# EAGLE design seismometer_panelboard (EAGLE 7.0.0)
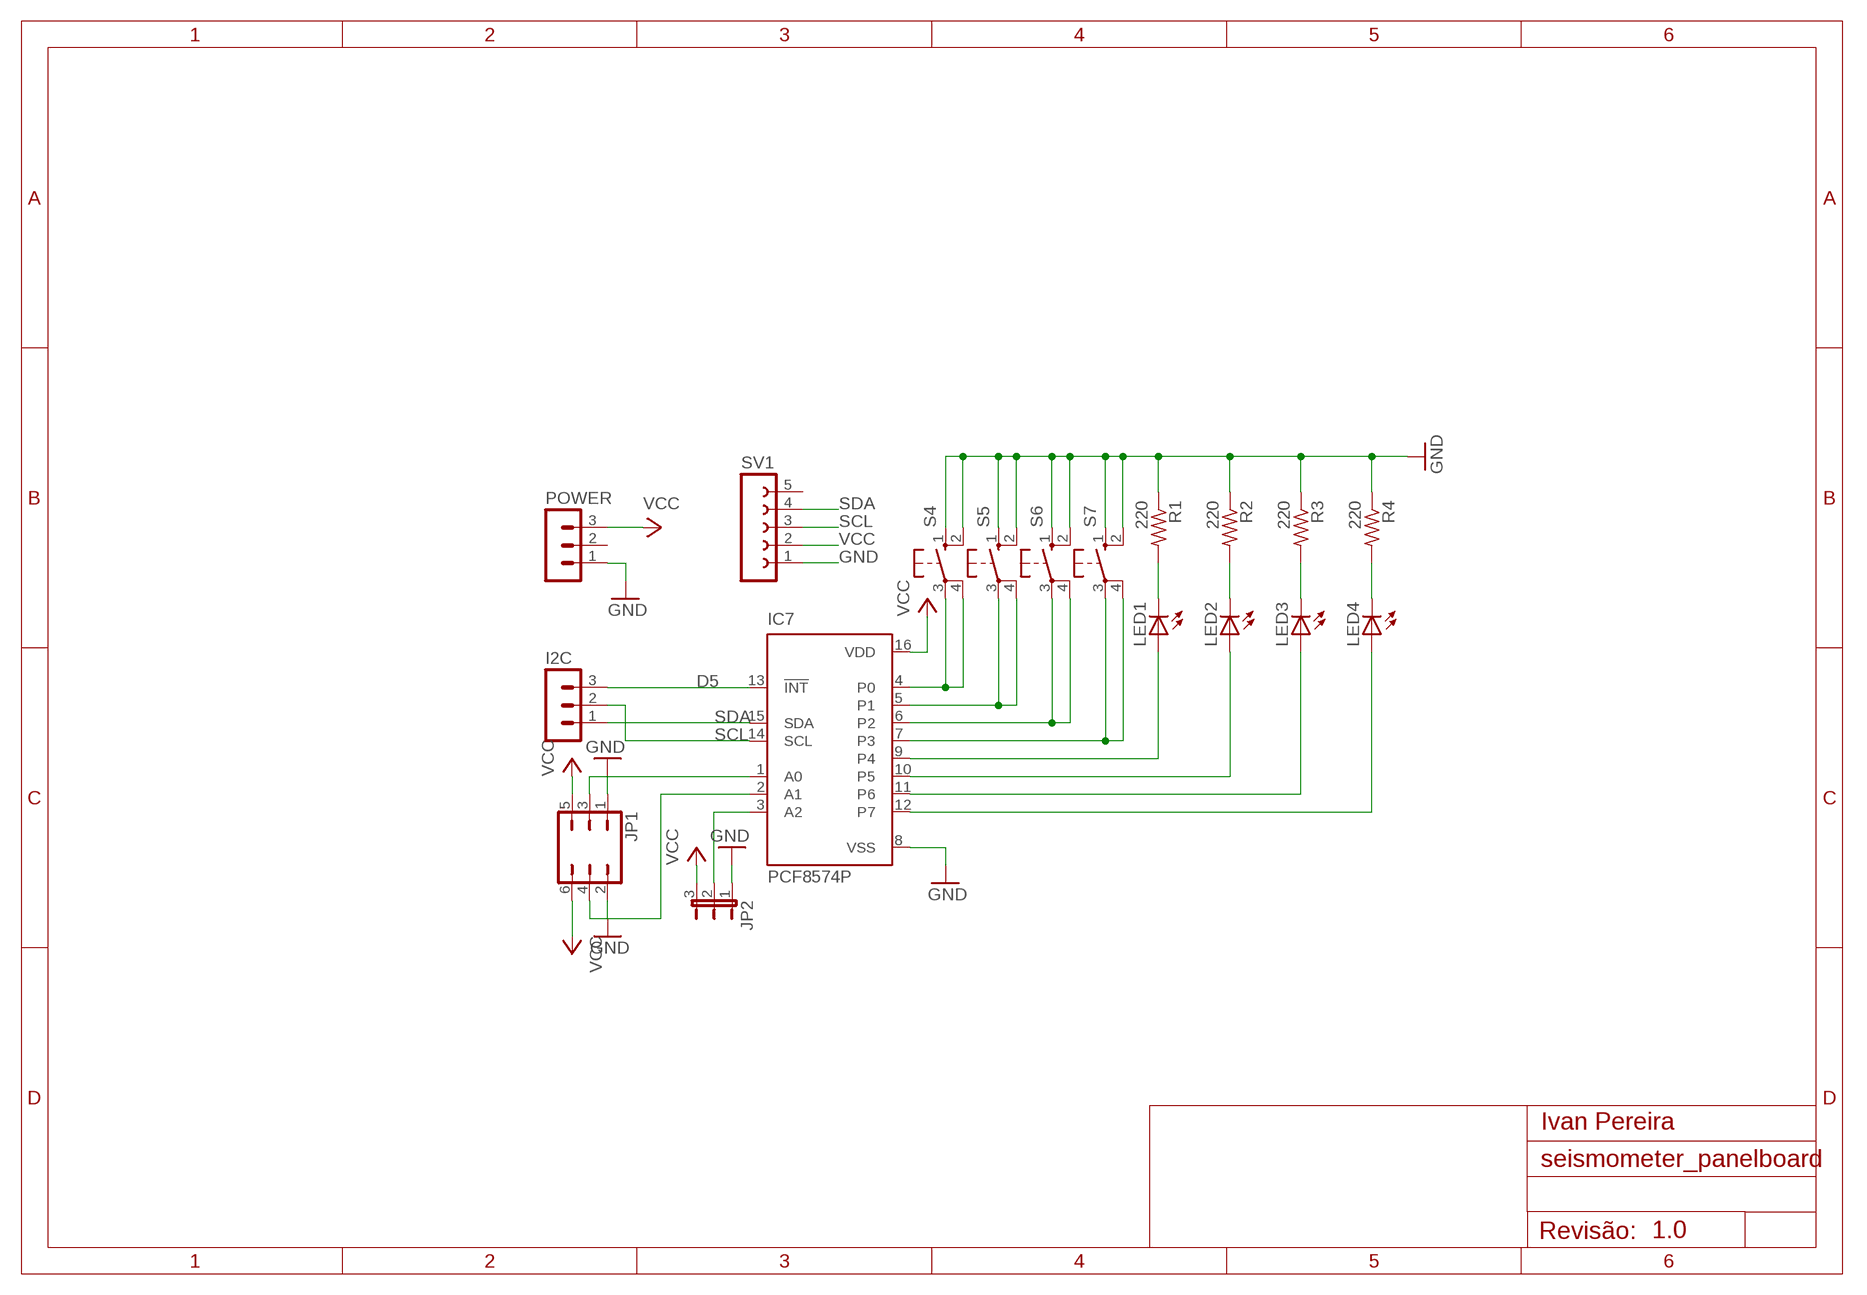
[diagram p0: schematic, sheet 1]
FRAME1 (A4L-LOC): AUTHOR: Ivan Pereira; REV: 1.0

## Parts
I2C  MA03-1  [MA03-1]
IC7  PCF8574P  [DIL16]
JP1  JP3Q  [JP3Q]
JP2  JP2E  [JP2]
LED1  LED3MM  [LED3MM]
LED2  LED3MM  [LED3MM]
LED3  LED3MM  [LED3MM]
LED4  LED3MM  [LED3MM]
POWER  MA03-1  [MA03-1]
R1  220  R-US_0207/10  [0207/10]
R2  220  R-US_0207/10  [0207/10]
R3  220  R-US_0207/10  [0207/10]
R4  220  R-US_0207/10  [0207/10]
S4  10-XX  [B3F-10XX]
S5  10-XX  [B3F-10XX]
S6  10-XX  [B3F-10XX]
S7  10-XX  [B3F-10XX]
SV1  FE05-1  [FE05-1]

## Nets
D5: I2C.3 IC7.13(!INT)
GND: IC7.8(VSS) JP1.1 JP1.2 JP2.1 POWER.1 R1.1 R2.1 R3.1 R4.1 S4.1(S) S4.2(S1) S5.1(S) S5.2(S1) S6.1(S) S6.2(S1) S7.1(S) S7.2(S1) SV1.1
N$1: IC7.9(P4) LED1.A
N$2: IC7.10(P5) LED2.A
N$3: IC7.11(P6) LED3.A
N$4: IC7.12(P7) LED4.A
N$5: LED1.K(C) R1.2
N$6: LED2.K(C) R2.2
N$7: LED3.K(C) R3.2
N$8: LED4.K(C) R4.2
N$9: IC7.1(A0) JP1.3
N$10: IC7.2(A1) JP1.4
N$11: IC7.3(A2) JP2.2
N$30: IC7.4(P0) S4.3(P) S4.4(P1)
N$32: IC7.6(P2) S6.3(P) S6.4(P1)
N$33: IC7.7(P3) S7.3(P) S7.4(P1)
N$34: IC7.5(P1) S5.3(P) S5.4(P1)
SCL: I2C.2 IC7.14(SCL) SV1.3
SDA: I2C.1 IC7.15(SDA) SV1.4
VCC: IC7.16(VDD) JP1.5 JP1.6 JP2.3 POWER.3 SV1.2
Unconnected: POWER.2 SV1.5

## Library data of the parts
I2C POWER = con-lstb:MA03-1: PIN HEADER; OC_FARNELL: unknown; OC_NEWARK: unknown
IC7 = micro-philips:PCF8574: I2C-Bus Remote 8-bit I/O expander http://www.semiconductors.philips.com/acrobat_download/datasheets/PCF8574_4.pdf; MPN: PCF8574PN; OC_FARNELL: 204020; OC_NEWARK: 11N8515
JP1 = jumper:JP3Q: JUMPER
JP2 = jumper:JP2E: JUMPER
LED1-LED4 = adafruit:LED: LED OSRAM: - CHIPLED LG R971, LG N971, LY N971, LG Q971, LY Q971, LO R971, LY R971 LH N974, LH R974 LS Q976, LO Q976, LY Q976 LO Q996 - Hyper CHIPLED LW Q18S LB Q993, LB Q99A, LB R99A - SideLED LS A670, LO A670, LY A670, LG A670, LP A670 LB A673, LV A673, LT A673, LW A673 LH A674 LY A675 LS A676, LA A676, LO A676, LY A676, LW A676 LS A679, LY A679, LG A679 - Hyper Micro SIDELED® LS Y876, LA Y876, LO Y876, LY Y876 LT Y87S - SmartLED LW L88C, LW L88S LB L89C, LB L89S, LG L890 LS L89K, LO L89K, LY L89K LS L896, LA L896, LO L896, LY L896 - TOPLED LS T670, LO T670, LY T670, LG T670, LP T670 LSG T670, LSP T670, LSY T670, LOP T670, LYG T670 LG T671, LOG T671, LSG T671 LB T673, LV T673, LT T673, LW T673 LH T674 LS T676, LA T676, LO T676, LY T676, LB T676, LH T676, LSB T676, LW T676 LB T67C, LV T67C, LT T67C, LS T67K, LO T67K, LY T67K, LW E67C LS E67B, LA E67B, LO E67B, LY E67B, LB E67C, LV E67C, LT E67C LW T67C LS T679, LY T679, LG T679 LS T770, LO T770, LY T770, LG T770, LP T770 LB T773, LV T773, LT T773, LW T773 LH T774 LS E675, LA E675, LY E675, LS T675 LS T776, LA T776, LO T776, LY T776, LB T776 LHGB T686 LT T68C, LB T68C - Hyper Mini TOPLED® LB M676 - Mini TOPLED Santana® LG M470 LS M47K, LO M47K, LY M47K Source: http://www.osram.convergy.de/
R1-R4 = adafruit:R-US_: RESISTOR, American symbol
S4-S7 = switch-omron:10-XX: OMRON SWITCH; MPN: B3F-1000; OC_FARNELL: 176432; OC_NEWARK: 36M3542
SV1 = con-lsta:FE05-1: FEMALE HEADER; OC_FARNELL: unknown; OC_NEWARK: unknown

## Board
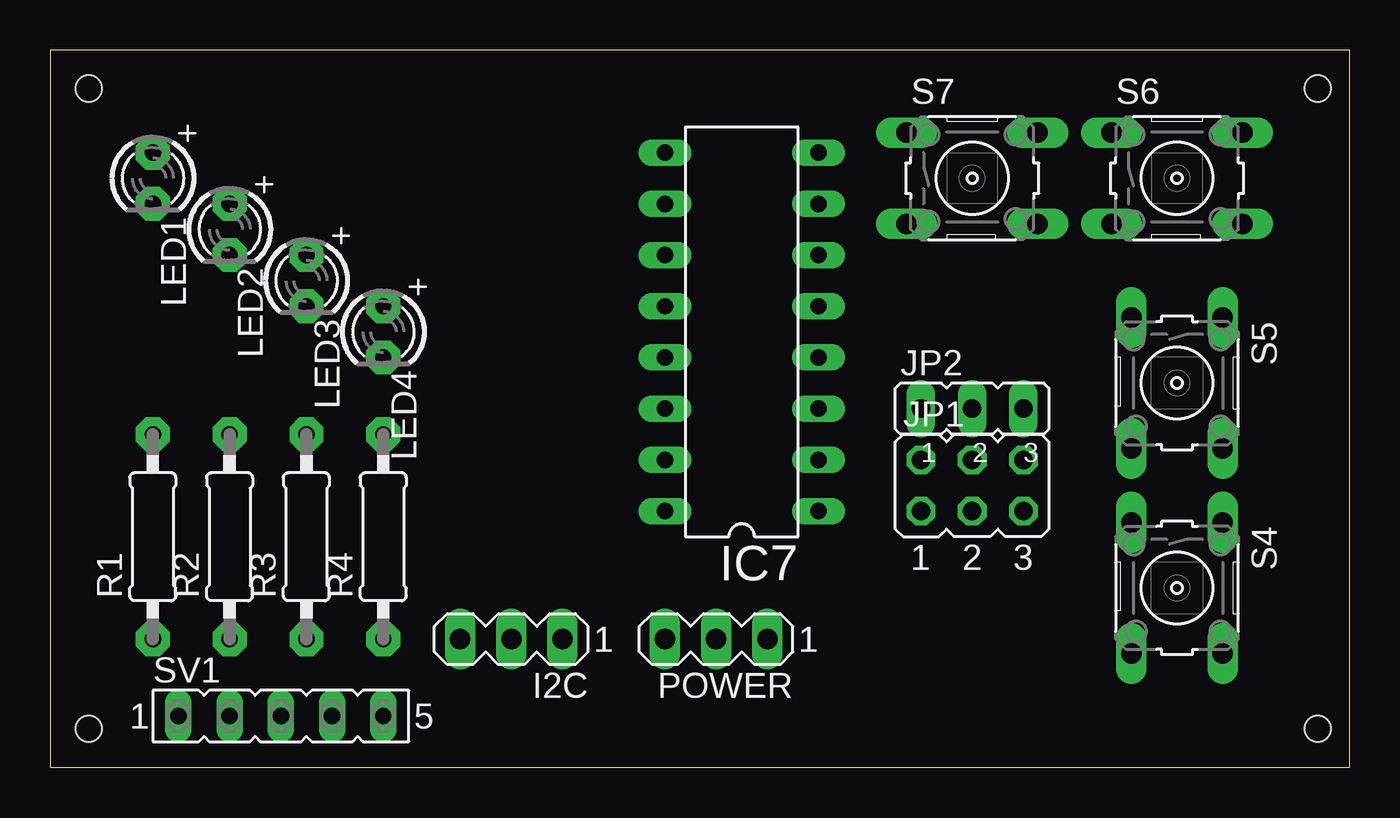
[diagram p1: board, top side]
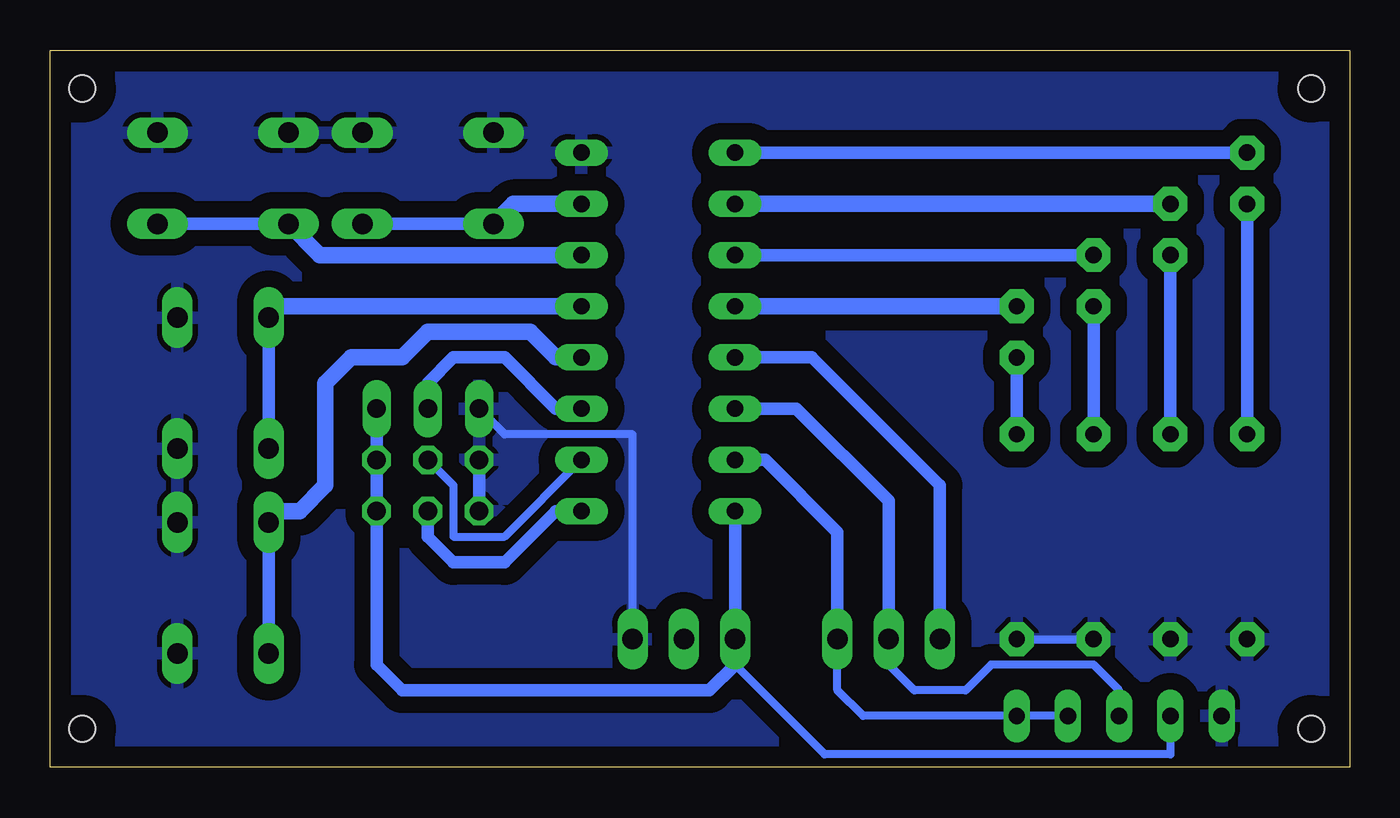
[diagram p2: board, bottom side, seen from below]

Size 64.44 x 35.55 mm. Coordinates in mm from the lower left corner, seen from the top.
Outline: 0,0 64.44,0 64.44,35.55 0,35.55 0,0
Copper layers (1*16): Top 0.035mm / dielectric 1.5mm / Bottom 0.035mm
Design rules "default": minimum track width 10mil, minimum drill 24mil, track to track 8mil, track to pad 8mil, pad to pad 8mil, via to via 8mil, smd to smd 8mil, copper to edge 40mil, drill to drill 8mil, minimum pad ring 10mil, minimum via ring 8mil, stop-mask expansion 4mil, vias tented up to drill 0mil, thermal gap 10mil
Holes 1.3 mm at 1.91,1.91 1.91,33.66 62.87,33.66 62.87,1.91

### Footprints (pad centres in the part's own frame; a part is rotated, then mirrored left to right if it is on the bottom)
MA03-1 = drill 1.016 long: 1 -2.54,0; 2 0,0; 3 2.54,0
DIL16 = drill 0.813 long: 1 -8.89,-3.81; 2 -6.35,-3.81; 3 -3.81,-3.81; 4 -1.27,-3.81; 5 1.27,-3.81; 6 3.81,-3.81; 7 6.35,-3.81; 8 8.89,-3.81; 9 8.89,3.81; 10 6.35,3.81; 11 3.81,3.81; 12 1.27,3.81; 13 -1.27,3.81; 14 -3.81,3.81; 15 -6.35,3.81; 16 -8.89,3.81
JP3Q = drill 0.914 octagon: 1 -2.54,-1.27; 2 -2.54,1.27; 3 0,-1.27; 4 0,1.27; 5 2.54,-1.27; 6 2.54,1.27
JP2 = drill 0.914 long: 1 -2.54,0; 2 0,0; 3 2.54,0
LED3MM = drill 0.813 pad 1.676 octagon: A -1.27,0; K 1.27,0
0207/10 = drill 0.813 pad 1.676 octagon: 1 -5.08,0; 2 5.08,0
B3F-10XX = drill 1.016 long: 1 -3.251,2.261; 2 3.251,2.261; 3 -3.251,-2.261; 4 3.251,-2.261
FE05-1 = drill 0.813 long: 1 -5.08,0; 2 -2.54,0; 3 0,0; 4 2.54,0; 5 5.08,0

### Placement (x,y rotation side)
I2C  22.86,6.35 180 top
IC7  34.29,21.59 90 top
JP1  45.72,13.97 0 top
JP2  45.72,17.78 0 top
LED1  5.08,29.21 270 top
LED2  8.89,26.67 270 top
LED3  12.7,24.13 270 top
LED4  16.51,21.59 270 top
POWER  33.02,6.35 180 top
R1  5.08,11.43 90 top
R2  8.89,11.43 90 top
R3  12.7,11.43 90 top
R4  16.51,11.43 90 top
S4  55.88,8.89 270 top
S5  55.88,19.05 270 top
S6  55.88,29.21 0 top
S7  45.72,29.21 0 top
SV1  11.43,2.54 0 top

### Tracks (layer width: path | path; a pad name or v marks a point on that pad's centre or on a via)
D5
  Bottom 0.61: I2C.3 20.32,13.97 26.67,20.32 IC7.13
GND
  Bottom 0.406: POWER.1 35.56,16.51 41.91,16.51 JP2.1 | R4.1 R3.1
  Bottom 0.61: JP1.1 JP1.2
  pour Bottom (isolate 0.813): 1.27,1.27 1.27,34.29 63.5,34.29 63.5,1.27
N$1
  Bottom 0.61: LED1.A IC7.9
N$2
  Bottom 0.813: IC7.10 LED2.A
N$3
  Bottom 0.61: LED3.A IC7.11
N$4
  Bottom 0.813: LED4.A IC7.12
N$5
  Bottom 0.61: R1.2 LED1.K
N$6
  Bottom 0.61: R2.2 LED2.K
N$7
  Bottom 0.61: R3.2 LED3.K
N$8
  Bottom 0.61: R4.2 LED4.K
N$9
  Bottom 0.61: IC7.1 39.37,12.7 41.91,10.16 44.45,10.16 45.72,11.43 JP1.3
N$10
  Bottom 0.406: JP1.4 44.45,13.97 44.45,11.43 41.91,11.43 IC7.2
N$11
  Bottom 0.61: IC7.3 39.37,17.78 41.91,20.32 44.45,20.32 45.72,19.05 JP2.2
N$30
  Bottom 0.61: S4.3 S4.4
  Bottom 0.813: IC7.4 39.37,20.32 40.64,21.59 45.72,21.59 46.99,20.32 49.53,20.32 50.8,19.05 50.8,13.97 52.07,12.7 53.06,12.7 S4.3
N$32
  Bottom 0.61: S6.3 S6.4
  Bottom 0.813: IC7.6 51.08,25.4 S6.3
N$33
  Bottom 0.61: S7.3 S7.4
  Bottom 0.813: IC7.7 41.48,27.94 S7.3
N$34
  Bottom 0.61: S5.3 S5.4
  Bottom 0.813: IC7.5 53.06,22.86 S5.3
SCL
  Bottom 0.406: SV1.3 11.43,3.81 12.7,5.08 17.78,5.08 19.05,3.81 21.59,3.81 22.86,5.08 I2C.2
  Bottom 0.61: I2C.2 22.86,13.2 27.44,17.78 IC7.14
SDA
  Bottom 0.406: SV1.4 24.13,2.54 25.4,3.81 I2C.1
  Bottom 0.61: I2C.1 25.4,11.65 28.99,15.24 IC7.15
VCC
  Bottom 0.406: SV1.2 8.89,0.64 26.04,0.64 30.48,5.08
  Bottom 0.61: IC7.16 POWER.3 30.48,5.08 31.75,3.81 46.99,3.81 48.26,5.08 JP1.5 JP1.6 JP2.3